# EAGLE design HB-UNI-SenAct-8-8-RC_V1.1 (EAGLE 9.4.2)
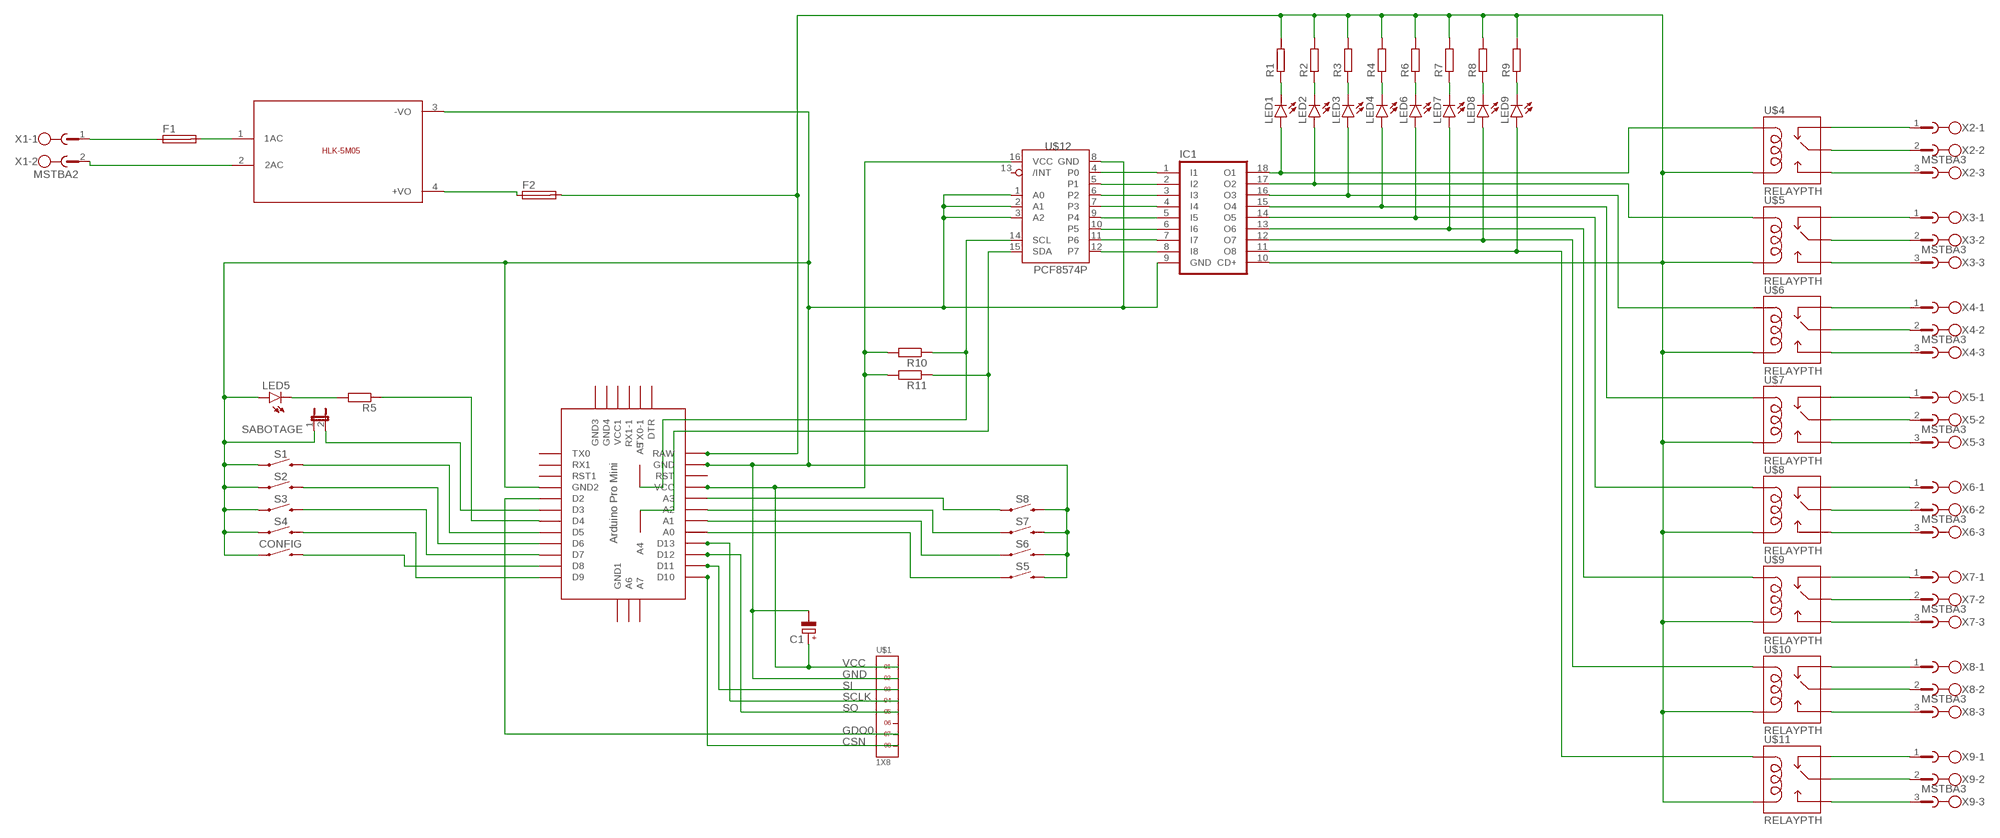
[diagram p0: schematic, sheet 1]

## Parts
C1  CPOL-EUE2.5-5  [E2,5-5]
CONFIG  MOMENTARY-SWITCH-SPST-PTH-6.0MM-KIT  [TACTILE_SWITCH_PTH_6.0MM_KIT]
F1  SH22,5A  [SH22,5A]
F2  SH22,5A  [SH22,5A]
IC1  ULN2803A  [DIL18]
LED1  LED3MM  [LED3MM]
LED2  LED3MM  [LED3MM]
LED3  LED3MM  [LED3MM]
LED4  LED3MM  [LED3MM]
LED5  LED3MM  [LED3MM]
LED6  LED3MM  [LED3MM]
LED7  LED3MM  [LED3MM]
LED8  LED3MM  [LED3MM]
LED9  LED3MM  [LED3MM]
R1  R-EU_0309/10  [0309/10]
R2  R-EU_0309/10  [0309/10]
R3  R-EU_0309/10  [0309/10]
R4  R-EU_0309/10  [0309/10]
R5  R-EU_0309/10  [0309/10]
R6  R-EU_0309/10  [0309/10]
R7  R-EU_0309/10  [0309/10]
R8  R-EU_0309/10  [0309/10]
R9  R-EU_0309/10  [0309/10]
R10  R-EU_0309/10  [0309/10]
R11  R-EU_0309/10  [0309/10]
S1  MOMENTARY-SWITCH-SPST-PTH-6.0MM  [TACTILE_SWITCH_PTH_6.0MM]
S2  MOMENTARY-SWITCH-SPST-PTH-6.0MM-KIT  [TACTILE_SWITCH_PTH_6.0MM_KIT]
S3  MOMENTARY-SWITCH-SPST-PTH-6.0MM-KIT  [TACTILE_SWITCH_PTH_6.0MM_KIT]
S4  MOMENTARY-SWITCH-SPST-PTH-6.0MM-KIT  [TACTILE_SWITCH_PTH_6.0MM_KIT]
S5  MOMENTARY-SWITCH-SPST-PTH-6.0MM-KIT  [TACTILE_SWITCH_PTH_6.0MM_KIT]
S6  MOMENTARY-SWITCH-SPST-PTH-6.0MM-KIT  [TACTILE_SWITCH_PTH_6.0MM_KIT]
S7  MOMENTARY-SWITCH-SPST-PTH-6.0MM-KIT  [TACTILE_SWITCH_PTH_6.0MM_KIT]
S8  MOMENTARY-SWITCH-SPST-PTH-6.0MM-KIT  [TACTILE_SWITCH_PTH_6.0MM_KIT]
SABOTAGE  JP1E  [JP1]
U$1  1X8  [1X8]
U$2  ABK-PRO-MINI  [ABK-PRO-MINI]
U$3  5VDC/5W  HLK-5M05  [HLK-5M05]
U$4  RELAYPTH  [SRD-05VDC-SL-C]
U$5  RELAYPTH  [SRD-05VDC-SL-C]
U$6  RELAYPTH  [SRD-05VDC-SL-C]
U$7  RELAYPTH  [SRD-05VDC-SL-C]
U$8  RELAYPTH  [SRD-05VDC-SL-C]
U$9  RELAYPTH  [SRD-05VDC-SL-C]
U$10  RELAYPTH  [SRD-05VDC-SL-C]
U$11  RELAYPTH  [SRD-05VDC-SL-C]
U$12  PCF8574P  [DIL16]
X1  MSTBA2  [MSTBA2]
X2  MSTBA3  [MSTBA3]
X3  MSTBA3  [MSTBA3]
X4  MSTBA3  [MSTBA3]
X5  MSTBA3  [MSTBA3]
X6  MSTBA3  [MSTBA3]
X7  MSTBA3  [MSTBA3]
X8  MSTBA3  [MSTBA3]
X9  MSTBA3  [MSTBA3]

## Nets
CSN: U$1.8 U$2.D10
GDO0: U$1.7 U$2.D2
GND: C1.- CONFIG.1 IC1.9(GND) LED5.A S1.1 S2.1 S3.1 S4.1 S5.3 S6.3 S7.3 S8.3 SABOTAGE.1 U$1.2 U$2.GND U$2.GND1(GND2) U$3.3(-VO) U$12.1(A0) U$12.2(A1) U$12.3(A2) U$12.8(GND)
N$1: F2.2 IC1.10(CD+) R1.2 R2.2 R3.2 R4.2 R6.2 R7.2 R8.2 R9.2 U$2.RAW U$4.COIL0 U$5.COIL0 U$6.COIL0 U$7.COIL0 U$8.COIL0 U$9.COIL0 U$10.COIL0 U$11.COIL0
N$2: U$11.SWCOMMON X9.2
N$3: U$10.SWCOMMON X8.2
N$4: U$9.SWCOMMON X7.2
N$5: U$8.SWCOMMON X6.2
N$6: U$10.SWCLOSED(SWCLOSE) X8.1
N$7: U$10.SWOPEN X8.3
N$8: U$11.SWCLOSED(SWCLOSE) X9.1
N$9: F1.1 X1.1
N$10: F2.1 U$3.4(+VO)
N$11: U$3.2(2AC) X1.2
N$12: S1.3 U$2.D5
N$13: S2.3 U$2.D6
N$14: S3.3 U$2.D7
N$15: S4.3 U$2.D9
N$16: CONFIG.3 U$2.D8
N$17: R5.1 U$2.D4
N$18: LED5.K(C) R5.2
N$19: F1.2 U$3.1(1AC)
N$20: SABOTAGE.2 U$2.D3
N$21: U$6.SWCLOSED(SWCLOSE) X4.1
N$22: U$7.SWCOMMON X5.2
N$23: U$6.SWOPEN X4.3
N$24: S5.1 U$2.A0
N$25: U$7.SWCLOSED(SWCLOSE) X5.1
N$26: U$6.SWCOMMON X4.2
N$27: U$7.SWOPEN X5.3
N$28: U$5.SWOPEN X3.3
N$29: U$5.SWCOMMON X3.2
N$30: U$5.SWCLOSED(SWCLOSE) X3.1
N$31: U$4.SWOPEN X2.3
N$32: U$4.SWCOMMON X2.2
N$33: U$4.SWCLOSED(SWCLOSE) X2.1
N$34: IC1.18(O1) LED1.A U$4.COIL1
N$35: IC1.17(O2) LED2.A U$5.COIL1
N$36: IC1.16(O3) LED3.A U$6.COIL1
N$37: IC1.15(O4) LED4.A U$7.COIL1
N$38: U$11.SWOPEN X9.3
N$39: U$9.SWOPEN X7.3
N$40: U$9.SWCLOSED(SWCLOSE) X7.1
N$41: U$8.SWOPEN X6.3
N$42: U$8.SWCLOSED(SWCLOSE) X6.1
N$43: IC1.14(O5) LED6.A U$8.COIL1
N$44: IC1.13(O6) LED7.A U$9.COIL1
N$45: IC1.12(O7) LED8.A U$10.COIL1
N$46: IC1.11(O8) LED9.A U$11.COIL1
N$47: IC1.1(I1) U$12.4(P0)
N$48: IC1.2(I2) U$12.5(P1)
N$49: IC1.3(I3) U$12.6(P2)
N$50: IC1.4(I4) U$12.7(P3)
N$51: IC1.5(I5) U$12.9(P4)
N$52: IC1.6(I6) U$12.10(P5)
N$53: IC1.7(I7) U$12.11(P6)
N$54: IC1.8(I8) U$12.12(P7)
N$55: LED1.K(C) R1.1
N$56: LED2.K(C) R2.1
N$57: LED3.K(C) R3.1
N$58: LED4.K(C) R4.1
N$59: LED6.K(C) R6.1
N$60: LED7.K(C) R7.1
N$61: LED8.K(C) R8.1
N$62: LED9.K(C) R9.1
N$63: R11.1 U$2.A4 U$12.15(SDA)
N$64: R10.1 U$2.A5 U$12.14(SCL)
N$65: S6.1 U$2.A1
N$66: S7.1 U$2.A2
N$67: S8.1 U$2.A3
SCLK: U$1.4 U$2.D13
SI: U$1.3 U$2.D11
SO: U$1.5 U$2.D12
VCC: C1.+ R10.2 R11.2 U$1.1 U$2.VCC U$12.16(VCC)
Unconnected: U$1.6 U$2.A6 U$2.A7 U$2.DTR U$2.GND2(GND3) U$2.GND3(GND4) U$2.GND4(GND1) U$2.RST U$2.RST1 U$2.RX1 U$2.RX1-1 U$2.TX0 U$2.TX0-1 U$2.VCC1 U$12.13(/INT)

## Library data of the parts
C1 = resistor:CPOL-EU: POLARIZED CAPACITOR, European symbol
CONFIG S1-S8 = SparkFun-Switches:MOMENTARY-SWITCH-SPST: Momentary Switch (Pushbutton) - SPST Normally-open (NO) SPST momentary switches (buttons, pushbuttons). Variants PTH-12MM - 12mm square, through-hole Momentary Pushbutton Switch - 12mm Square <https://www.sparkfun.com/products/9190> (COM-09190) PTH-6.0MM, PTH-6.0MM-KIT - 6.0mm square, through-hole Mini Pushbutton Switch <https://www.sparkfun.com/products/97> (COM-00097) KIT package intended for soldering kit's - only one side of pads' copper is exposed. PTH-RIGHT-ANGLE-KIT - Right-angle, through-hole Right Angle Tactile Button <https://www.sparkfun.com/products/10791> - Used on SparkFun BigTime Watch Kit <https://www.sparkfun.com/products/11734> SMD-12MM - 12mm square, surface-mount Tactile Button - SMD (12mm) <https://www.sparkfun.com/products/12993> (COM-12993) Used on SparkFun PicoBoard <https://www.sparkfun.com/products/11888> SMD-4.5MM - 4.5mm Square Trackball Switch Used on SparkFun Blackberry Trackballer Breakout <https://www.sparkfun.com/products/13169> SMD-4.6MMX2.8MM - 4.60mm x 2.80mm, surface mount Used on SparkFun SAMD21 Mini Breakout <https://www.sparkfun.com/products/13664> SMD-5.2MM, SMD-5.2-REDUNDANT - 5.2mm square, surface-mount Mini Pushbutton Switch - SMD <https://www.sparkfun.com/products/8720> (COM-08720) Used on Arduino Pro Mini <https://www.sparkfun.com/products/11114> REDUNDANT package connects both switch circuits together SMD-6.0X3.5MM - 6.0 x 3.5mm, surface mount Momentary Reset Switch SMD <https://www.sparkfun.com/products/8229> (COM-08229) SMD-6.2MM-TALL - 6.2mm square, surface mount Tactile Button - SMD (6mm) <https://www.sparkfun.com/products/12992> Used on SparkFun Digital Sandbox <https://www.sparkfun.com/products/12651> SMD-RIGHT-ANGLE - Right-angle, surface mount Used on SparkFun Block for Intel® Edison - Arduino <https://www.sparkfun.com/products/13036>; PROD_ID: SWCH-08441; SF_SKU: COM-00097
F1 F2 = fuse:SH22,5A: FUSE HOLDER grid 22,5mm, isolated cap OGN0031 8201, Schurter (Buerklin); MPN: 0031.7701.11; OC_FARNELL: unknown; OC_NEWARK: 04F1224
IC1 = uln-udn:ULN2803A: DRIVER ARRAY
LED1-LED9 = led:LED: LED OSRAM: - CHIPLED LG R971, LG N971, LY N971, LG Q971, LY Q971, LO R971, LY R971 LH N974, LH R974 LS Q976, LO Q976, LY Q976 LO Q996 - Hyper CHIPLED LW Q18S LB Q993, LB Q99A, LB R99A - SideLED LS A670, LO A670, LY A670, LG A670, LP A670 LB A673, LV A673, LT A673, LW A673 LH A674 LY A675 LS A676, LA A676, LO A676, LY A676, LW A676 LS A679, LY A679, LG A679 - Hyper Micro SIDELED® LS Y876, LA Y876, LO Y876, LY Y876 LT Y87S - SmartLED LW L88C, LW L88S LB L89C, LB L89S, LG L890 LS L89K, LO L89K, LY L89K LS L896, LA L896, LO L896, LY L896 - TOPLED LS T670, LO T670, LY T670, LG T670, LP T670 LSG T670, LSP T670, LSY T670, LOP T670, LYG T670 LG T671, LOG T671, LSG T671 LB T673, LV T673, LT T673, LW T673 LH T674 LS T676, LA T676, LO T676, LY T676, LB T676, LH T676, LSB T676, LW T676 LB T67C, LV T67C, LT T67C, LS T67K, LO T67K, LY T67K, LW E67C LS E67B, LA E67B, LO E67B, LY E67B, LB E67C, LV E67C, LT E67C LW T67C LS T679, LY T679, LG T679 LS T770, LO T770, LY T770, LG T770, LP T770 LB T773, LV T773, LT T773, LW T773 LH T774 LS E675, LA E675, LY E675, LS T675 LS T776, LA T776, LO T776, LY T776, LB T776 LHGB T686 LT T68C, LB T68C - Hyper Mini TOPLED® LB M676 - Mini TOPLED Santana® LG M470 LS M47K, LO M47K, LY M47K Source: http://www.osram.convergy.de LUXEON: - LUMILED® LXK2-PW12-R00, LXK2-PW12-S00, LXK2-PW14-U00, LXK2-PW14-V00 LXK2-PM12-R00, LXK2-PM12-S00, LXK2-PM14-U00 LXK2-PE12-Q00, LXK2-PE12-R00, LXK2-PE12-S00, LXK2-PE14-T00, LXK2-PE14-U00 LXK2-PB12-K00, LXK2-PB12-L00, LXK2-PB12-M00, LXK2-PB14-N00, LXK2-PB14-P00, LXK2-PB14-Q00 LXK2-PR12-L00, LXK2-PR12-M00, LXK2-PR14-Q00, LXK2-PR14-R00 LXK2-PD12-Q00, LXK2-PD12-R00, LXK2-PD12-S00 LXK2-PH12-R00, LXK2-PH12-S00 LXK2-PL12-P00, LXK2-PL12-Q00, LXK2-PL12-R00 Source: www.luxeon.com KINGBRIGHT: KA-3528ASYC Source: www.kingbright.com
R1-R11 = resistor:R-EU_: RESISTOR, European symbol
SABOTAGE = jumper:JP1E: JUMPER
U$1 = headers(2mm):1X8
U$2 = Arduino-clone:ABK-PRO-MINI: ABK Pro-Mini Arduino Clone
U$3 = HLK-5M05:HLK-5M05: HLK-5M05 is an 5Volt/5W smps developed by HI-LINK; SIZE: 23x38(mm)
U$4-U$11 = SRD-05VDC-SL-C:RELAY: SPDT relay (COM-00101)
U$12 = i2c:PCF8574: Remote 8-Bit I/O Expander for I²C Bus
X1 = con-phoenix-508:MSTBA2: PHOENIX; MF: FARNELL; MPN: 1757242; OC_FARNELL: 3705171; OC_NEWARK: 71C4161
X2-X9 = con-phoenix-508:MSTBA3: PHOENIX; MF: FARNELL; MPN: 1757255; OC_FARNELL: 3705183; OC_NEWARK: 71C4162

## Board
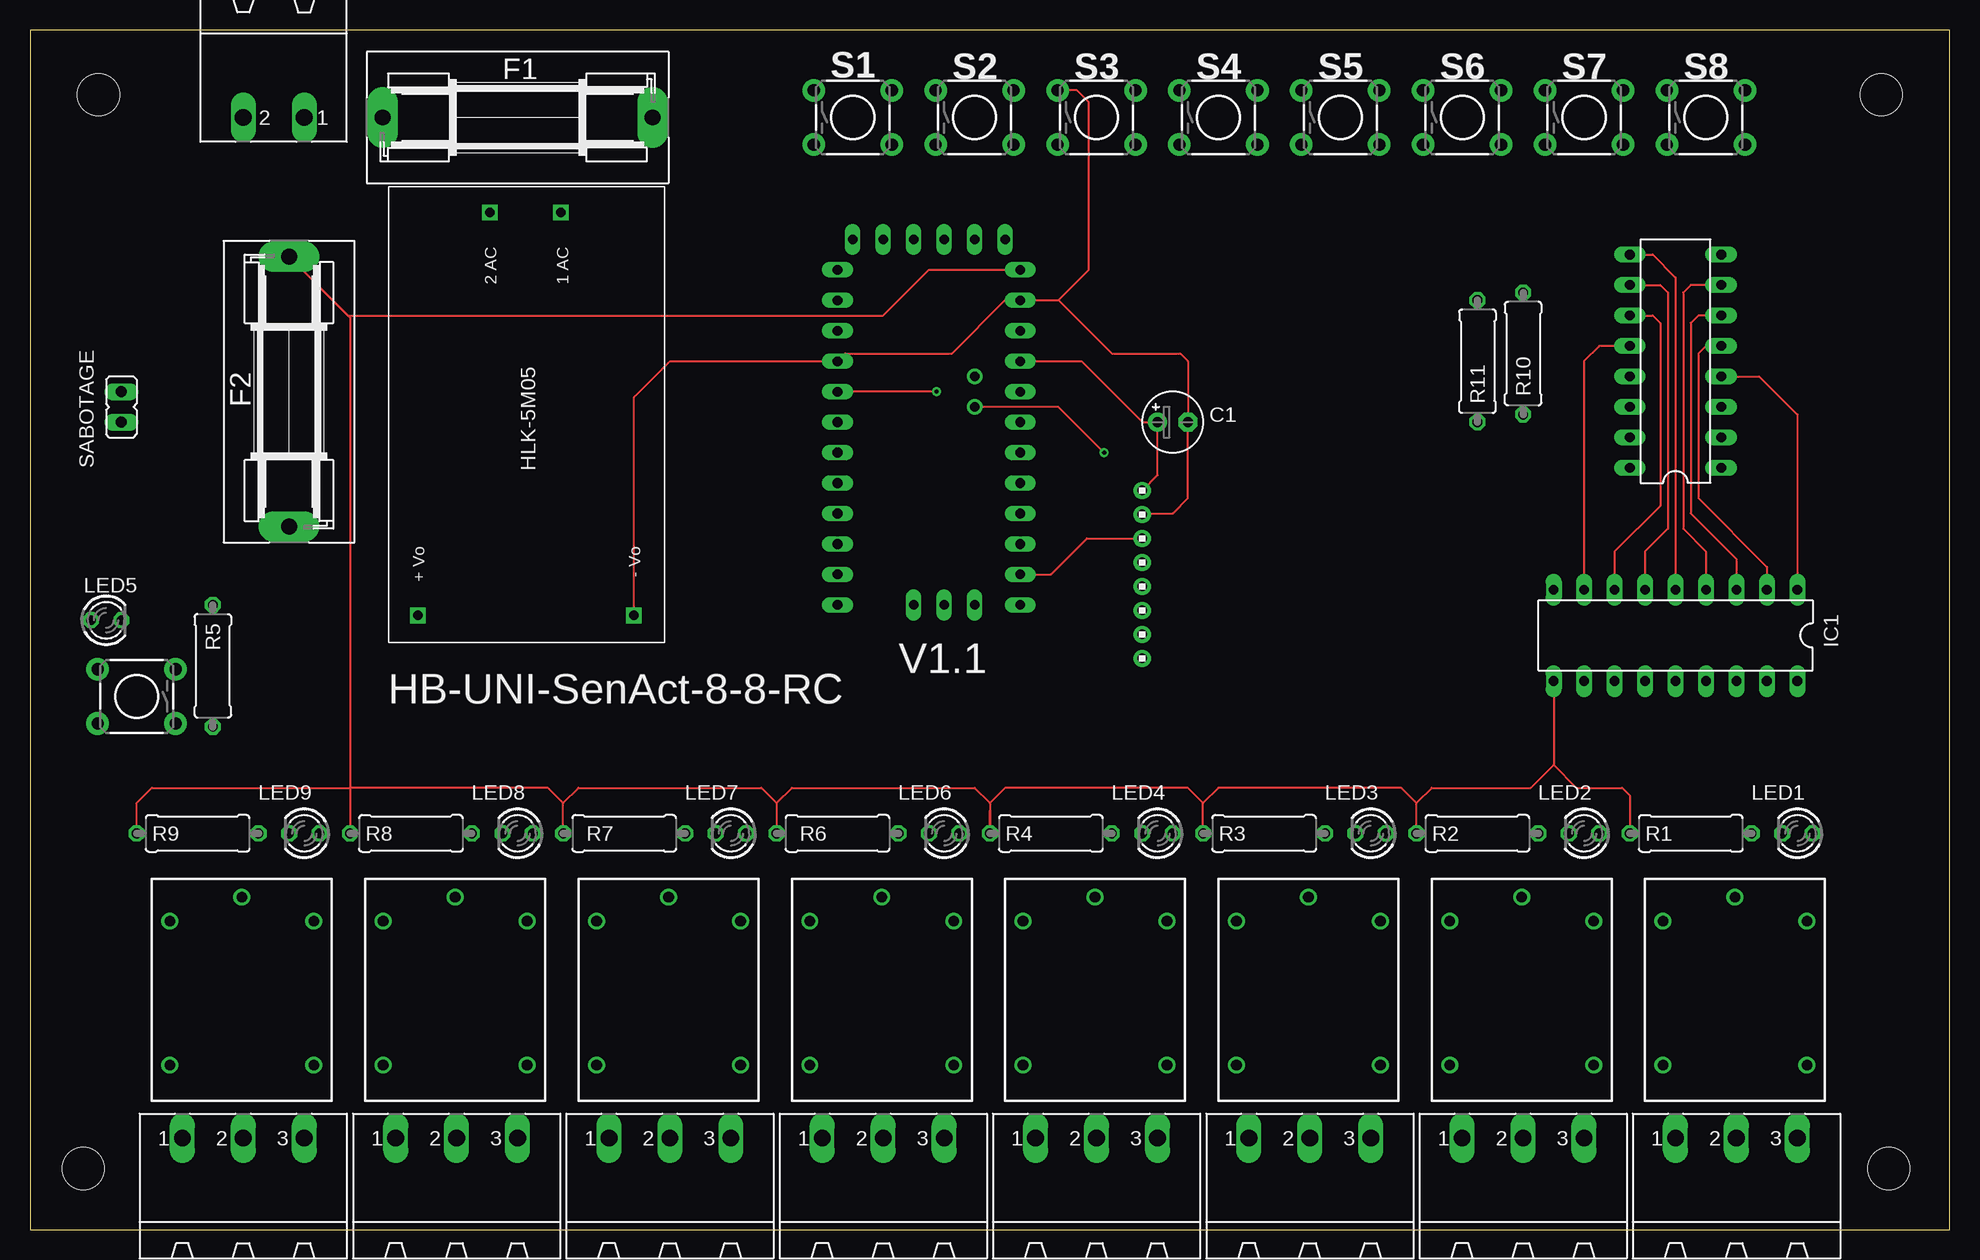
[diagram p1: board, top side]
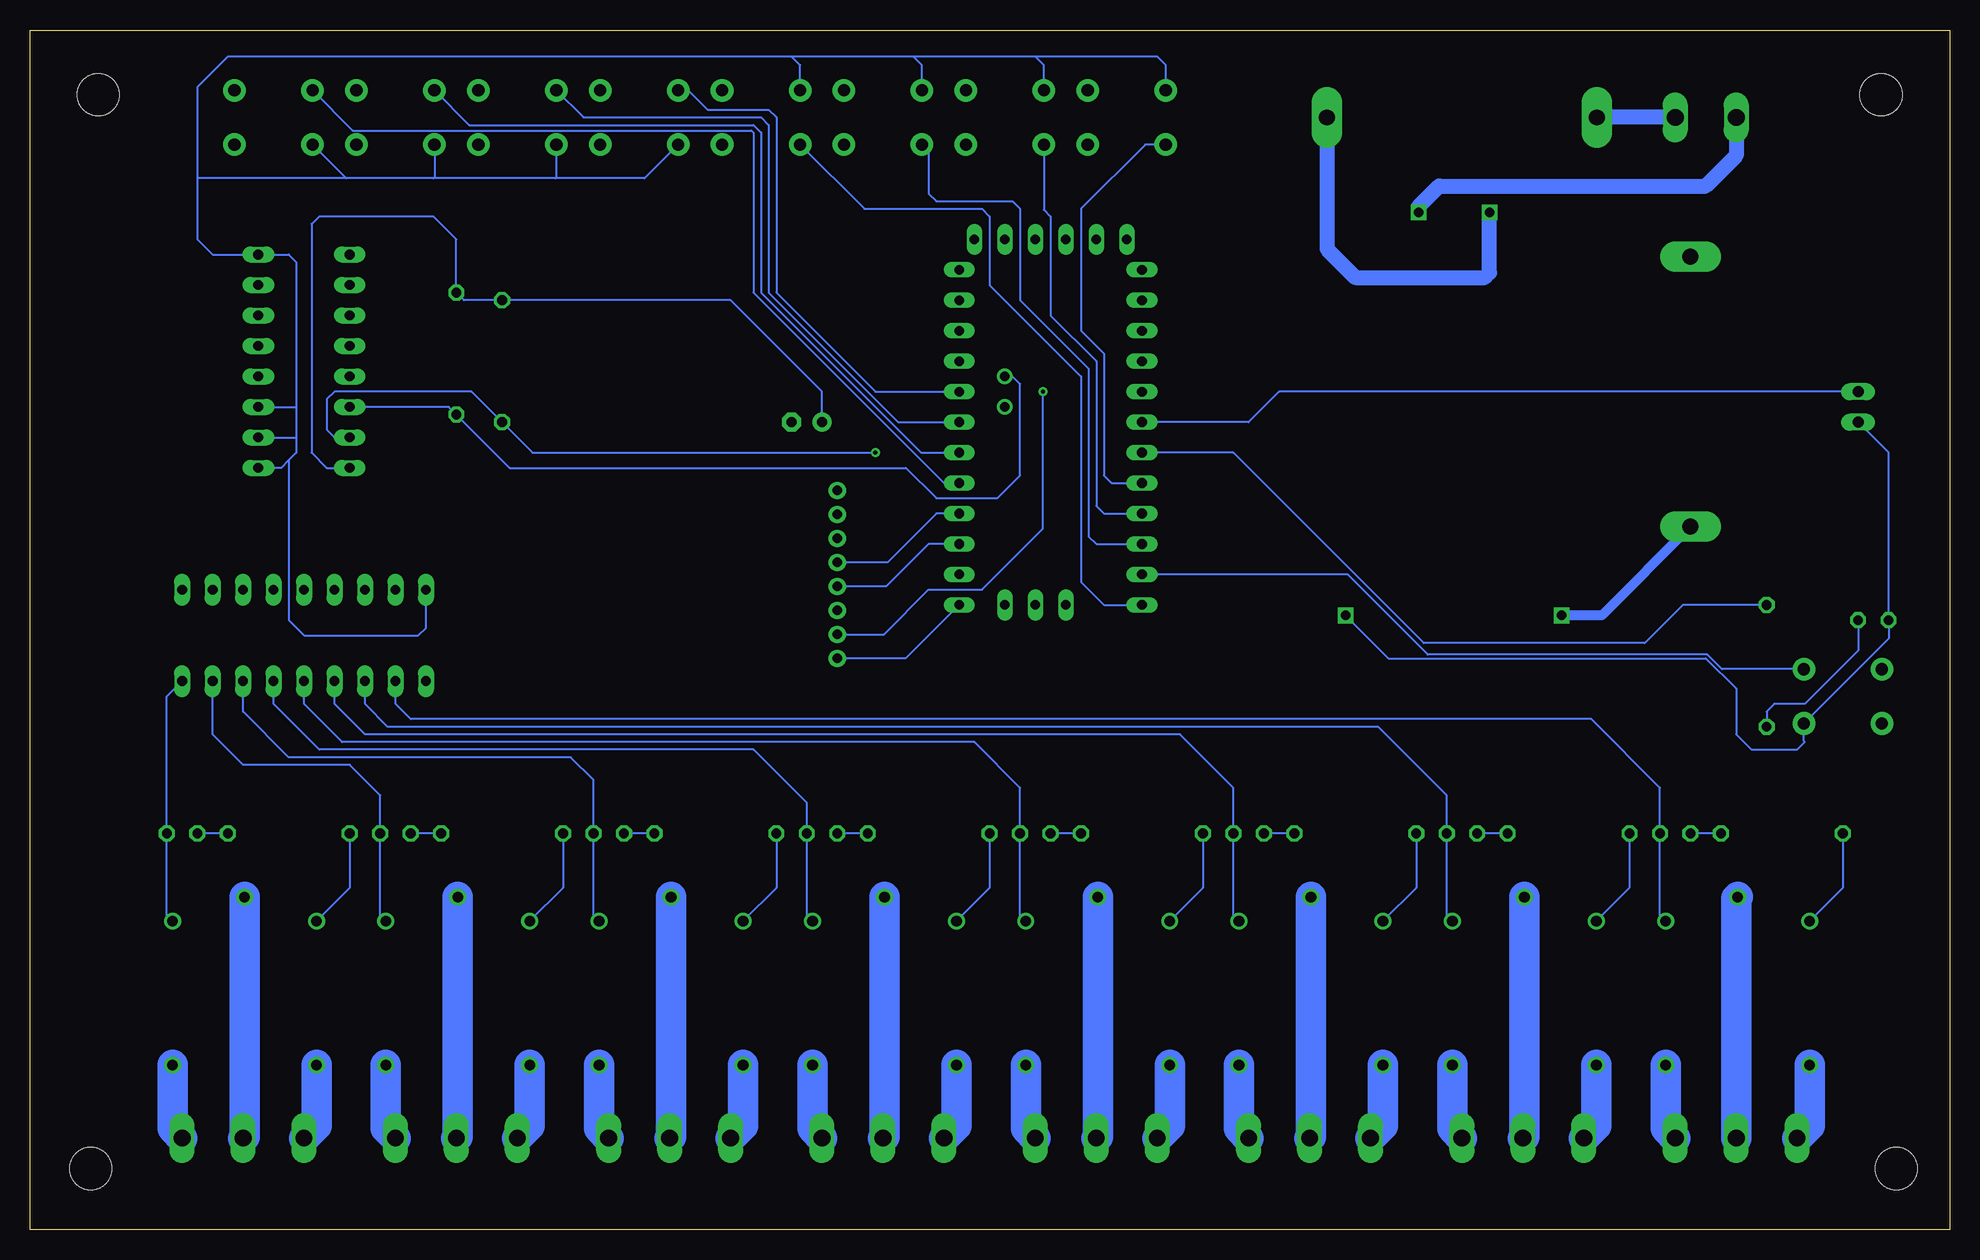
[diagram p2: board, bottom side, seen from below]

Size 160 x 100 mm. Coordinates in mm from the lower left corner, seen from the top.
Outline: 0,0 160,0 160,100 0,100 0,0
Copper layers (1*16): Top 0.035mm / dielectric 1.5mm / Bottom 0.035mm
Design rules "default": minimum track width 6mil, minimum drill 0.35mm, track to track 6mil, track to pad 6mil, pad to pad 6mil, via to via 6mil, smd to smd 6mil, copper to edge 40mil, drill to drill 6mil, minimum pad ring 10mil, minimum via ring 8mil, stop-mask expansion 4mil, vias tented up to drill 0mil, thermal gap 10mil
Holes 3.5 mm at 5.71,94.61 154.31,94.61 4.45,5.08 154.94,5.08

### Footprints (pad centres in the part's own frame; a part is rotated, then mirrored left to right if it is on the bottom)
E2,5-5 = drill 0.813 pad 1.6: + -1.27,0 | drill 0.813 pad 1.6 octagon: - 1.27,0
TACTILE_SWITCH_PTH_6.0MM_KIT = drill 1.016 pad 1.88: 1 -3.251,2.261; 2 3.251,2.261; 3 -3.251,-2.261; 4 3.251,-2.261
SH22,5A = drill 1.321 pad 2.54 long: 1 -11.252,0; 2 11.252,0
DIL18 = drill 0.813 long: 1 -10.16,-3.81; 2 -7.62,-3.81; 3 -5.08,-3.81; 4 -2.54,-3.81; 5 0,-3.81; 6 2.54,-3.81; 7 5.08,-3.81; 8 7.62,-3.81; 9 10.16,-3.81; 10 10.16,3.81; 11 7.62,3.81; 12 5.08,3.81; 13 2.54,3.81; 14 0,3.81; 15 -2.54,3.81; 16 -5.08,3.81; 17 -7.62,3.81; 18 -10.16,3.81
LED3MM = drill 0.813 octagon: A -1.27,0; K 1.27,0
0309/10 = drill 0.813 octagon: 1 -5.08,0; 2 5.08,0
TACTILE_SWITCH_PTH_6.0MM = drill 1.016 pad 1.88: 1 -3.251,2.261; 2 3.251,2.261; 3 -3.251,-2.261; 4 3.251,-2.261
JP1 = drill 0.914 long: 1 0,-1.27; 2 0,1.27
1X8 = drill 0.8 pad 1.422: 1 -7,0; 2 -5,0; 3 -3,0; 4 -1,0; 5 1,0; 6 3,0; 7 5,0; 8 7,0
ABK-PRO-MINI = drill 0.8 long: A0 10.16,-3.81; A1 10.16,-6.35; A2 10.16,-8.89; A3 10.16,-11.43; A6 3.81,-21.59; A7 6.35,-21.59; D2 -5.08,-3.81; D3 -5.08,-6.35; D4 -5.08,-8.89; D5 -5.08,-11.43; D6 -5.08,-13.97; D7 -5.08,-16.51; D8 -5.08,-19.05; D9 -5.08,-21.59; D10 10.16,-21.59; D11 10.16,-19.05; D12 10.16,-16.51; D13 10.16,-13.97; DTR 8.89,8.89; GND 10.16,3.81; GND1 -5.08,-1.27; GND2 -3.81,8.89; GND3 -1.27,8.89; GND4 1.27,-21.59; RAW 10.16,6.35; RST 10.16,1.27; RST1 -5.08,1.27; RX1 -5.08,3.81; RX1-1 3.81,8.89; TX0 -5.08,6.35; TX0-1 6.35,8.89; VCC 10.16,-1.27; VCC1 1.27,8.89 | drill 0.8: A4 6.35,-5.08; A5 6.35,-2.54
HLK-5M05 = drill 0.8 square: 1 -16.85,-2.93; 2 -16.85,2.97; 3 16.75,9.07; 4 16.75,-8.93
SRD-05VDC-SL-C = drill 0.9: COIL0 -5.39,-6.12; COIL1 -5.39,5.88; SWCLOSED 6.61,-6.12; SWCOMMON -7.39,-0.12; SWOPEN 6.61,5.88
DIL16 = drill 0.813 long: 1 -8.89,-3.81; 2 -6.35,-3.81; 3 -3.81,-3.81; 4 -1.27,-3.81; 5 1.27,-3.81; 6 3.81,-3.81; 7 6.35,-3.81; 8 8.89,-3.81; 9 8.89,3.81; 10 6.35,3.81; 11 3.81,3.81; 12 1.27,3.81; 13 -1.27,3.81; 14 -3.81,3.81; 15 -6.35,3.81; 16 -8.89,3.81
MSTBA2 = drill 1.397 long: 1 -2.54,5.08; 2 2.54,5.08
MSTBA3 = drill 1.397 long: 1 -5.08,5.08; 2 0,5.08; 3 5.08,5.08

### Placement (x,y rotation side)
C1  95.25,67.31 0 top
CONFIG  8.89,44.45 180 top
F1  40.64,92.71 0 top
F2  21.59,69.85 90 top
IC1  137.16,49.53 180 top
LED1  147.32,33.02 180 top
LED2  129.54,33.02 180 top
LED3  111.76,33.02 180 top
LED4  93.98,33.02 180 top
LED5  6.35,50.8 0 top
LED6  76.2,33.02 180 top
LED7  58.42,33.02 180 top
LED8  40.64,33.02 180 top
LED9  22.86,33.02 180 top
R1  138.43,33.02 180 top
R2  120.65,33.02 180 top
R3  102.87,33.02 180 top
R4  85.09,33.02 180 top
R5  15.24,46.99 270 top
R6  67.31,33.02 180 top
R7  49.53,33.02 180 top
R8  31.75,33.02 180 top
R9  13.97,33.02 180 top
R10  124.46,73.03 90 top
R11  120.65,72.39 90 top
S1  68.58,92.71 0 top
S2  78.74,92.71 0 top
S3  88.9,92.71 0 top
S4  99.06,92.71 0 top
S5  109.22,92.71 0 top
S6  119.38,92.71 0 top
S7  129.54,92.71 0 top
S8  139.7,92.71 0 top
SABOTAGE  7.62,68.58 0 top
U$1  92.71,54.61 270 top
U$2  72.39,73.66 0 top
U$3  41.27,67.94 270 top
U$4  142.24,20.32 270 top
U$5  124.46,20.32 270 top
U$6  106.68,20.32 270 top
U$7  88.9,20.32 270 top
U$8  71.12,20.32 270 top
U$9  53.34,20.32 270 top
U$10  35.56,20.32 270 top
U$11  17.78,20.32 270 top
U$12  137.16,72.39 90 top
X1  20.32,97.79 180 top
X2  142.24,2.54 0 top
X3  124.46,2.54 0 top
X4  106.68,2.54 0 top
X5  88.9,2.54 0 top
X6  71.12,2.54 0 top
X7  53.34,2.54 0 top
X8  35.56,2.54 0 top
X9  17.78,2.54 0 top

### Tracks (layer width: path | path; a pad name or v marks a point on that pad's centre or on a via)
CSN
  Bottom 0.152: U$2.D10 87.01,47.61 U$1.8
GDO0  (via drill 0.35)
  Top 0.152: v75.56,69.85 U$2.D2
  Bottom 0.152: U$1.7 88.82,49.61 85.09,53.34 80.64,53.34 75.56,58.42 v75.56,69.85
GND
  Top 0.152: U$3.3 50.34,69.39 53.34,72.39 U$2.GND1 67.94,73.03 76.83,73.03 81.28,77.47 U$2.GND 85.72,77.47 | 85.72,77.47 88.27,80.01 88.27,93.98 87.27,94.97 S3.1 | 85.72,77.47 90.17,73.03 95.89,73.03 96.52,72.39 C1.- 96.52,60.96 95.25,59.69 92.79,59.69 U$1.2
  Bottom 0.152: S1.1 65.33,97.08 66.04,97.79 76.2,97.79 | 76.2,97.79 86.36,97.79 | 86.36,97.79 96.52,97.79 | 96.52,97.79 143.51,97.79 146.05,95.25 146.05,87.63 | 146.05,87.63 146.05,82.55 144.78,81.28 U$12.8 138.43,81.28 137.79,80.64 137.79,68.58 | S2.1 75.49,97.08 76.2,97.79 | S3.1 85.65,97.08 86.36,97.79 | S4.1 95.81,97.08 96.52,97.79 | S5.3 108.79,87.63 116.2,87.63 | 133.63,87.63 S8.3 | 116.2,87.63 126.36,87.63 | 126.36,87.63 133.63,87.63 | S6.3 116.13,87.71 116.2,87.63 | S7.3 126.29,87.71 126.36,87.63 | 133.63,87.63 146.05,87.63 | SABOTAGE.1 5.08,64.77 LED5.A 5.08,49.25 CONFIG.1 12.14,40.72 12.06,40.64 12.7,40.01 16.51,40.01 17.78,41.27 17.78,45.09 20.32,47.62 46.77,47.62 U$3.3 | 137.79,68.58 137.79,66.04 | 137.79,66.04 137.79,64.77 138.43,64.14 | 138.43,64.14 139.06,63.5 U$12.1 | U$12.2 137.79,66.04 | U$12.3 137.79,68.58 | 138.43,64.14 138.43,50.8 137.16,49.53 127.64,49.53 127,50.16 IC1.9
N$1
  Top 0.152: 26.67,36.83 26.67,76.02 F2.2 26.49,76.2 71.12,76.2 74.93,80.01 U$2.RAW | 26.67,36.83 R8.2 | IC1.10 127,38.73 | R1.2 133.35,36.2 132.72,36.83 128.91,36.83 127,38.73 | 127,38.73 125.09,36.83 116.84,36.83 115.57,35.56 | R2.2 115.57,35.56 | 115.57,35.56 114.3,36.83 99.06,36.83 97.79,35.56 | R9.2 8.89,35.56 10.16,36.83 26.67,36.83 | 44.45,35.56 43.18,36.83 26.67,36.83 | R7.2 44.45,35.56 | 44.45,35.56 45.72,36.83 60.96,36.83 62.23,35.56 | 62.23,35.56 R6.2 | R3.2 97.79,35.56 | 97.79,35.56 96.52,36.83 81.28,36.83 80.01,35.56 | 62.23,35.56 63.5,36.83 78.74,36.83 80.01,35.56 | 80.01,34.92 R4.2 80.01,35.56
  Bottom 0.152: R9.2 8.89,28.48 U$11.COIL0 | R8.2 26.67,28.48 U$10.COIL0 | R7.2 44.45,28.48 U$9.COIL0 | R6.2 62.23,28.48 U$8.COIL0 | R4.2 80.01,28.48 U$7.COIL0 | R3.2 97.79,28.48 U$6.COIL0 | R2.2 115.57,28.48 U$5.COIL0 | R1.2 133.35,28.48 U$4.COIL0
N$2
  Bottom 2.54: U$11.SWCOMMON 17.78,27.59 X9.2
N$3
  Bottom 2.54: U$10.SWCOMMON 35.44,7.74 X8.2
N$4
  Bottom 2.54: U$9.SWCOMMON 53.22,7.74 X7.2
N$5
  Bottom 2.54: U$8.SWCOMMON 71,7.74 X6.2
N$6
  Bottom 2.54: U$10.SWCLOSED 29.44,8.66 X8.1
N$7
  Bottom 2.54: U$10.SWOPEN 41.44,8.42 X8.3
N$8
  Bottom 2.54: U$11.SWCLOSED 11.66,8.66 X9.1
N$9
  Bottom 1.27: X1.1 F1.1
N$10
  Bottom 0.813: F2.1 28.99,51.2 U$3.4
N$11
  Bottom 1.27: X1.2 17.78,89.53 20.32,87 42.55,87 44.24,85.3 U$3.2
N$12
  Bottom 0.152: S1.3 67.03,90.45 72.39,85.09 72.39,74.93 70.48,73.03 70.48,62.87 69.85,62.23 U$2.D5
N$13
  Bottom 0.152: S2.3 75.49,85.01 74.93,84.45 74.93,76.2 71.12,72.39 71.12,60.33 70.48,59.69 U$2.D6
N$14
  Bottom 0.152: S3.3 85.09,89.89 85.09,86.36 84.45,85.72 78.11,85.72 77.47,85.09 77.47,77.47 71.75,71.75 71.75,57.78 71.12,57.15 U$2.D7
N$15
  Bottom 0.152: S4.3 90.45,85.09 80.64,85.09 80.01,84.45 80.01,78.74 72.39,71.12 72.39,53.98 70.48,52.07 U$2.D9
N$16
  Bottom 0.152: CONFIG.3 18.98,46.71 20.19,47.93 43.48,47.93 50.16,54.61 U$2.D8
N$17
  Bottom 0.152: R5.1 22.23,52.07 25.4,48.9 43.81,48.9 59.69,64.77 U$2.D4
N$18
  Bottom 0.152: LED5.K 7.62,48.26 12.06,43.81 14.61,43.81 15.24,43.18 R5.2
N$19
  Bottom 1.27: F1.2 51.89,81.74 49.53,79.38 38.73,79.38 38.34,79.77 U$3.1
N$20
  Bottom 0.152: SABOTAGE.2 55.88,69.85 58.42,67.31 U$2.D3
N$21
  Bottom 2.54: U$6.SWCLOSED 100.56,8.66 X4.1
N$22
  Bottom 2.54: U$7.SWCOMMON 88.78,7.74 X5.2
N$23
  Bottom 2.54: U$6.SWOPEN 112.56,8.42 X4.3
N$24
  Bottom 0.152: S5.1 105.13,94.97 103.5,93.34 98.42,93.34 97.79,92.71 97.79,78.11 89.53,69.85 U$2.A0
N$25
  Bottom 2.54: U$7.SWCLOSED 82.78,8.66 X5.1
N$26
  Bottom 2.54: U$6.SWCOMMON 106.56,7.74 X4.2
N$27
  Bottom 2.54: U$7.SWOPEN 94.78,8.42 X5.3
N$28
  Bottom 2.54: U$5.SWOPEN 130.34,8.42 X3.3
N$29
  Bottom 2.54: U$5.SWCOMMON 124.34,7.74 X3.2
N$30
  Bottom 2.54: U$5.SWCLOSED 118.34,8.66 X3.1
N$31
  Bottom 2.54: U$4.SWOPEN 148.12,8.42 X2.3
N$32
  Bottom 2.54: U$4.SWCOMMON 142.12,7.74 X2.2
N$33
  Bottom 2.54: U$4.SWCLOSED 136.12,8.66 X2.1
N$34
  Bottom 0.152: U$4.COIL1 148.59,26.18 LED1.A 148.59,44.45 IC1.18
N$35
  Bottom 0.152: U$5.COIL1 130.81,26.18 LED2.A 130.81,36.2 133.35,38.73 142.24,38.73 144.78,41.27 IC1.17
N$36
  Bottom 0.152: U$6.COIL1 113.03,26.18 LED3.A 113.03,37.47 114.94,39.37 138.43,39.37 142.24,43.18 IC1.16
N$37
  Bottom 0.152: U$7.COIL1 95.25,26.18 LED4.A 95.25,35.56 99.69,40.01 135.89,40.01 139.7,43.81 IC1.15
N$38
  Bottom 2.54: U$11.SWOPEN 23.66,8.42 X9.3
N$39
  Bottom 2.54: U$9.SWOPEN 59.22,8.42 X7.3
N$40
  Bottom 2.54: U$9.SWCLOSED 47.22,8.66 X7.1
N$41
  Bottom 2.54: U$8.SWOPEN 77,8.42 X6.3
N$42
  Bottom 2.54: U$8.SWCLOSED 65,8.66 X6.1
N$43
  Bottom 0.152: U$8.COIL1 77.47,26.18 LED6.A 77.47,36.83 81.28,40.64 133.99,40.64 137.16,43.81 IC1.14
N$44
  Bottom 0.152: U$9.COIL1 59.69,26.18 LED7.A 59.69,36.83 64.14,41.27 132.08,41.27 134.62,43.81 IC1.13
N$45
  Bottom 0.152: U$10.COIL1 41.91,26.18 LED8.A 41.91,36.2 47.62,41.91 130.18,41.91 132.08,43.81 IC1.12
N$46
  Bottom 0.152: U$11.COIL1 24.13,26.18 LED9.A 24.13,36.83 29.84,42.55 128.27,42.55 129.54,43.81 IC1.11
N$47
  Top 0.152: U$12.4 144.15,71.12 147.32,67.94 IC1.1
N$48
  Top 0.152: U$12.5 139.7,73.66 139.06,73.03 139.06,60.96 144.78,55.24 IC1.2
N$49
  Top 0.152: U$12.6 139.06,76.2 138.43,75.56 138.43,59.69 142.24,55.88 IC1.3
N$50
  Top 0.152: U$12.7 138.43,78.74 137.79,78.11 137.79,58.42 139.7,56.52 IC1.4
N$51
  Top 0.152: U$12.9 135.25,81.28 137.16,79.38 IC1.5
N$52
  Top 0.152: U$12.10 135.89,78.74 136.53,78.11 136.53,58.42 134.62,56.52 IC1.6
N$53
  Top 0.152: U$12.11 135.25,76.2 135.89,75.56 135.89,60.33 132.08,56.52 IC1.7
N$54
  Top 0.152: U$12.12 130.81,73.66 129.54,72.39 IC1.8
N$55
  Bottom 0.152: R1.1 LED1.K
N$56
  Bottom 0.152: R2.1 LED2.K
N$57
  Bottom 0.152: R3.1 LED3.K
N$58
  Bottom 0.152: R4.1 LED4.K
N$59
  Bottom 0.152: R6.1 LED6.K
N$60
  Bottom 0.152: R7.1 LED7.K
N$61
  Bottom 0.152: R8.1 LED8.K
N$62
  Bottom 0.152: R9.1 LED9.K
N$63  (via drill 0.35)
  Top 0.152: v89.53,64.77 85.72,68.58 U$2.A4
  Bottom 0.152: v89.53,64.77 118.11,64.77 R11.1 123.19,69.85 134.62,69.85 135.25,69.22 135.25,66.67 134.62,66.04 U$12.15
N$64
  Bottom 0.152: U$2.A5 78.11,71.12 77.47,70.48 77.47,62.87 79.38,60.96 84.45,60.96 87,63.5 120.02,63.5 R10.1 125.09,68.58 U$12.14
N$65
  Bottom 0.152: S6.1 113.87,92.71 99.06,92.71 98.42,92.08 98.42,78.11 87.63,67.31 U$2.A1
N$66
  Bottom 0.152: S7.1 123.39,92.08 99.69,92.08 99.06,91.44 99.06,78.11 85.72,64.77 U$2.A2
N$67
  Bottom 0.152: S8.1 133.1,91.62 99.87,91.62 99.69,91.44 99.69,78.11 83.82,62.23 U$2.A3
SCLK
  Bottom 0.152: U$2.D13 84.45,59.69 88.53,55.61 U$1.4
SI
  Top 0.152: U$2.D11 85.09,54.61 88.09,57.61 U$1.3
SO
  Bottom 0.152: U$2.D12 85.09,57.15 88.63,53.61 U$1.5
VCC
  Top 0.152: U$1.1 93.98,62.88 C1.+ 92.71,67.31 87.63,72.39 U$2.VCC
  Bottom 0.152: C1.+ 93.98,69.85 101.6,77.47 R11.2 123.83,77.47 R10.2 124.46,82.55 126.36,84.45 135.89,84.45 136.53,83.82 136.53,64.77 135.25,63.5 U$12.16

### Text on the board
tNames: V1.1 | HB-UNI-SenAct-8-8-RC